# EAGLE design shield (EAGLE 9.1.3)
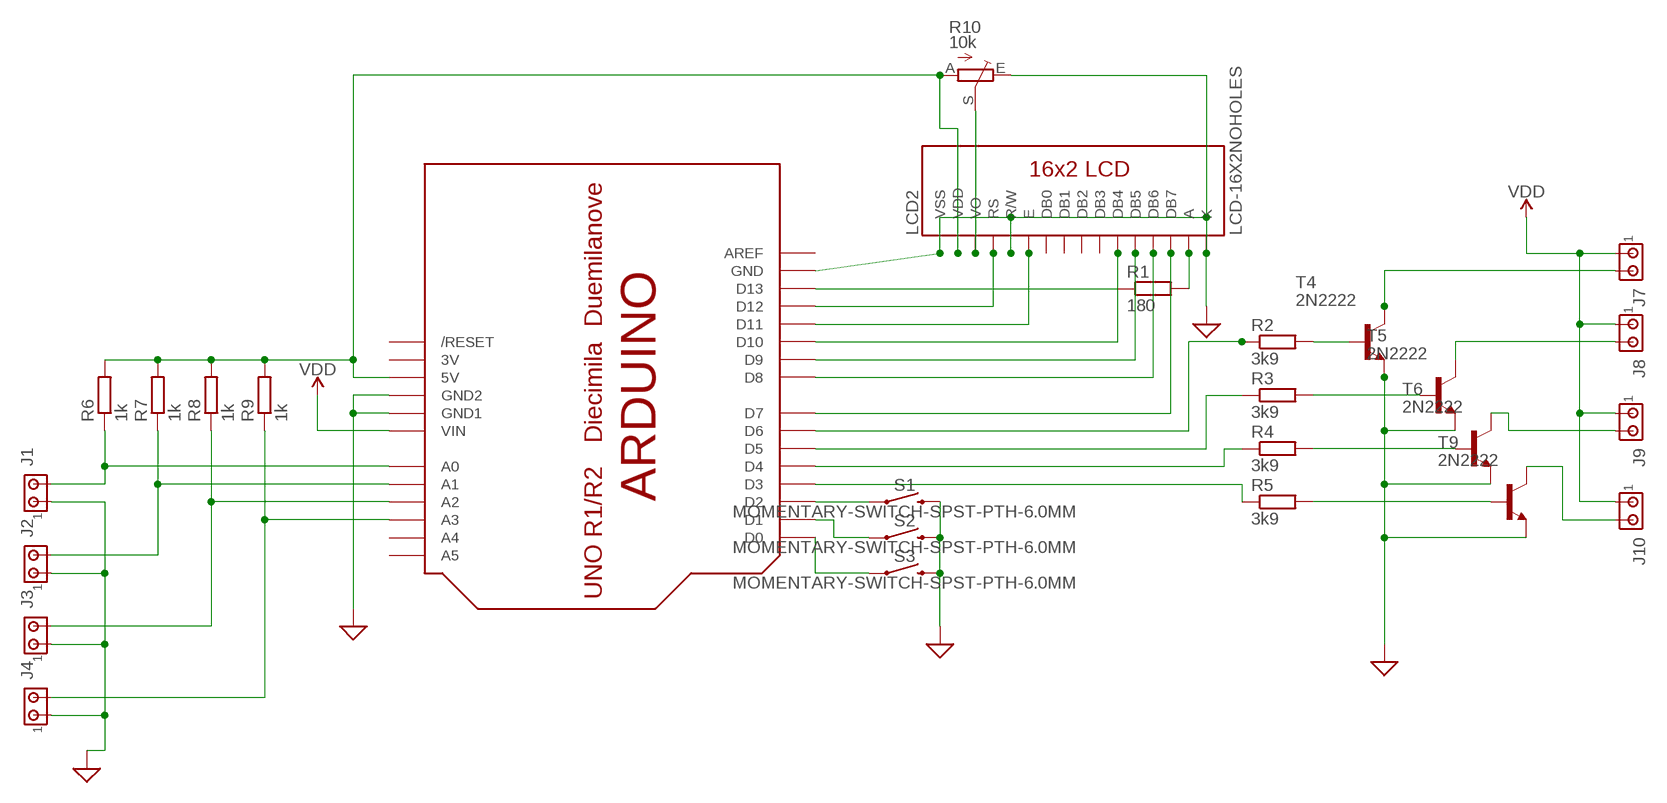
[diagram p0: schematic, sheet 1]

## Parts
J1  MTA02-100  [10X02MTA]
J2  MTA02-100  [10X02MTA]
J3  MTA02-100  [10X02MTA]
J4  MTA02-100  [10X02MTA]
J7  MTA02-100  [10X02MTA]
J8  MTA02-100  [10X02MTA]
J9  MTA02-100  [10X02MTA]
J10  MTA02-100  [10X02MTA]
LCD2  LCD-16X2NOHOLES  [LCD-16X2_NOHOLESNOSILK]
R1  180  R-EU_0207/10  [0207/10]
R2  3k9  R-EU_0207/10  [0207/10]
R3  3k9  R-EU_0207/10  [0207/10]
R4  3k9  R-EU_0207/10  [0207/10]
R5  3k9  R-EU_0207/10  [0207/10]
R6  1k  R-EU_0207/10  [0207/10]
R7  1k  R-EU_0207/10  [0207/10]
R8  1k  R-EU_0207/10  [0207/10]
R9  1k  R-EU_0207/10  [0207/10]
R10  10k  TRIM_EU-B25P  [B25P]
S1  MOMENTARY-SWITCH-SPST-PTH-6.0MM  [TACTILE_SWITCH_PTH_6.0MM]
S2  MOMENTARY-SWITCH-SPST-PTH-6.0MM  [TACTILE_SWITCH_PTH_6.0MM]
S3  MOMENTARY-SWITCH-SPST-PTH-6.0MM  [TACTILE_SWITCH_PTH_6.0MM]
T4  2N2222  [TO92-EBC-OVAL]
T5  2N2222  [TO92-EBC-OVAL]
T6  2N2222  [TO92-EBC-OVAL]
T9  2N2222  [TO92-EBC-OVAL]
U$1  ARDUINO-NOHOLE  [ARDUINO-NOHOLE]

## Nets
GND: J1.1 J2.1 J3.1 J4.1 LCD2.1(VSS) LCD2.5(R/W) LCD2.16(K) R10.E S1.3 S2.3 S3.3 T4.E T5.E T6.E T9.E U$1.GND U$1.GND1 U$1.GND2 ; supply symbol labelled SUP
N$1: LCD2.15(A) R1.2
N$6: LCD2.11(DB4) U$1.D10
N$7: LCD2.12(DB5) U$1.D9
N$8: LCD2.13(DB6) U$1.D8
N$9: LCD2.14(DB7) U$1.D7
N$10: LCD2.6(E) U$1.D11
N$11: R3.1 U$1.D5
N$12: J1.2 R6.1 U$1.A0
N$13: LCD2.4(RS) U$1.D12
N$14: LCD2.2(VDD) R6.2 R7.2 R8.2 R9.2 R10.A U$1.5V
N$15: LCD2.3(VO) R10.S
N$16: R4.1 U$1.D4
N$17: R1.1 U$1.D13
N$18: R5.1 U$1.D3
N$19: S3.1 U$1.D0
N$20: R2.1 U$1.D6
N$21: S1.1 U$1.D2
N$22: S2.1 U$1.D1
N$23: J8.2 T5.C
N$24: R3.2 T5.B
N$25: J7.2 T4.C
N$26: R2.2 T4.B
N$27: J2.2 R7.1 U$1.A1
N$28: R4.2 T6.B
N$29: R5.2 T9.B
N$30: J10.2 T9.C
N$31: J9.2 T6.C
N$32: J3.2 R8.1 U$1.A2
N$33: J4.2 R9.1 U$1.A3
VDD: J7.1 J8.1 J9.1 J10.1 U$1.VIN
Unconnected: LCD2.7(DB0) LCD2.8(DB1) LCD2.9(DB2) LCD2.10(DB3) U$1.A4 U$1.A5 U$1.AREF U$1.RESET(/RESET)

## Power pins joined to a net without a drawn wire
3V: U$1.3V

## Library data of the parts
J1-J4 J7-J10 = con-amp:MTA02-100: AMP connector; OC_FARNELL: unknown
LCD2 = SparkFun-Displays:LCD-16X2: Standard text-only 16x2 parallel input LCD Basic 16 character by 2 line display. Typically utilizes the extremely common HD44780 parallel interface chipset SparkFun Products: Basic 16x2 Green <https://www.sparkfun.com/products/255> Basic 8x2 Green <https://www.sparkfun.com/products/11122>; OC_FARNELL: unknown; SF_ID: LCD-00255
R1-R9 = rcl:R-EU_: RESISTOR, European symbol; OC_FARNELL: unknown; SPICEPREFIX: R
R10 = pot:TRIM_EU-: POTENTIOMETER; OC_FARNELL: unknown
S1-S3 = SparkFun-Switches:MOMENTARY-SWITCH-SPST: Momentary Switch (Pushbutton) - SPST Normally-open (NO) SPST momentary switches (buttons, pushbuttons). Variants PTH-12MM - 12mm square, through-hole Momentary Pushbutton Switch - 12mm Square <https://www.sparkfun.com/products/9190> (COM-09190) PTH-6.0MM, PTH-6.0MM-KIT - 6.0mm square, through-hole Mini Pushbutton Switch <https://www.sparkfun.com/products/97> (COM-00097) KIT package intended for soldering kit's - only one side of pads' copper is exposed. PTH-RIGHT-ANGLE-KIT - Right-angle, through-hole Right Angle Tactile Button <https://www.sparkfun.com/products/10791> - Used on SparkFun BigTime Watch Kit <https://www.sparkfun.com/products/11734> SMD-12MM - 12mm square, surface-mount Tactile Button - SMD (12mm) <https://www.sparkfun.com/products/12993> (COM-12993) Used on SparkFun PicoBoard <https://www.sparkfun.com/products/11888> SMD-4.5MM - 4.5mm Square Trackball Switch Used on SparkFun Blackberry Trackballer Breakout <https://www.sparkfun.com/products/13169> SMD-4.6MMX2.8MM - 4.60mm x 2.80mm, surface mount Used on SparkFun SAMD21 Mini Breakout <https://www.sparkfun.com/products/13664> SMD-5.2MM, SMD-5.2-REDUNDANT - 5.2mm square, surface-mount Mini Pushbutton Switch - SMD <https://www.sparkfun.com/products/8720> (COM-08720) Used on Arduino Pro Mini <https://www.sparkfun.com/products/11114> REDUNDANT package connects both switch circuits together SMD-6.0X3.5MM - 6.0 x 3.5mm, surface mount Momentary Reset Switch SMD <https://www.sparkfun.com/products/8229> (COM-08229) SMD-6.2MM-TALL - 6.2mm square, surface mount Tactile Button - SMD (6mm) <https://www.sparkfun.com/products/12992> Used on SparkFun Digital Sandbox <https://www.sparkfun.com/products/12651> SMD-RIGHT-ANGLE - Right-angle, surface mount Used on SparkFun Block for Intel® Edison - Arduino <https://www.sparkfun.com/products/13036>; OC_FARNELL: unknown; PROD_ID: SWCH-08441; SF_SKU: COM-00097
T4-T6 T9 = adafruit:2N2222: NPN TRANSISTOR Big oval pads; OC_FARNELL: unknown
U$1 = adafruit:ARDUINO: Arduino Diecimila/Duemilanove Make a shield with ease, this package has all the named pins as well as the two mounting drill holes and an outline of the USB and DC power connector. The outline is on the DIMENSION layer, so if your board house uses it they will cut the outline to match. http://www.ladyada.net/library/pcb/eaglelibrary.html; OC_FARNELL: unknown

## Net classes
0 default: width 0.762 mm, drill 0.787 mm, clearance 0.254 mm

## Board
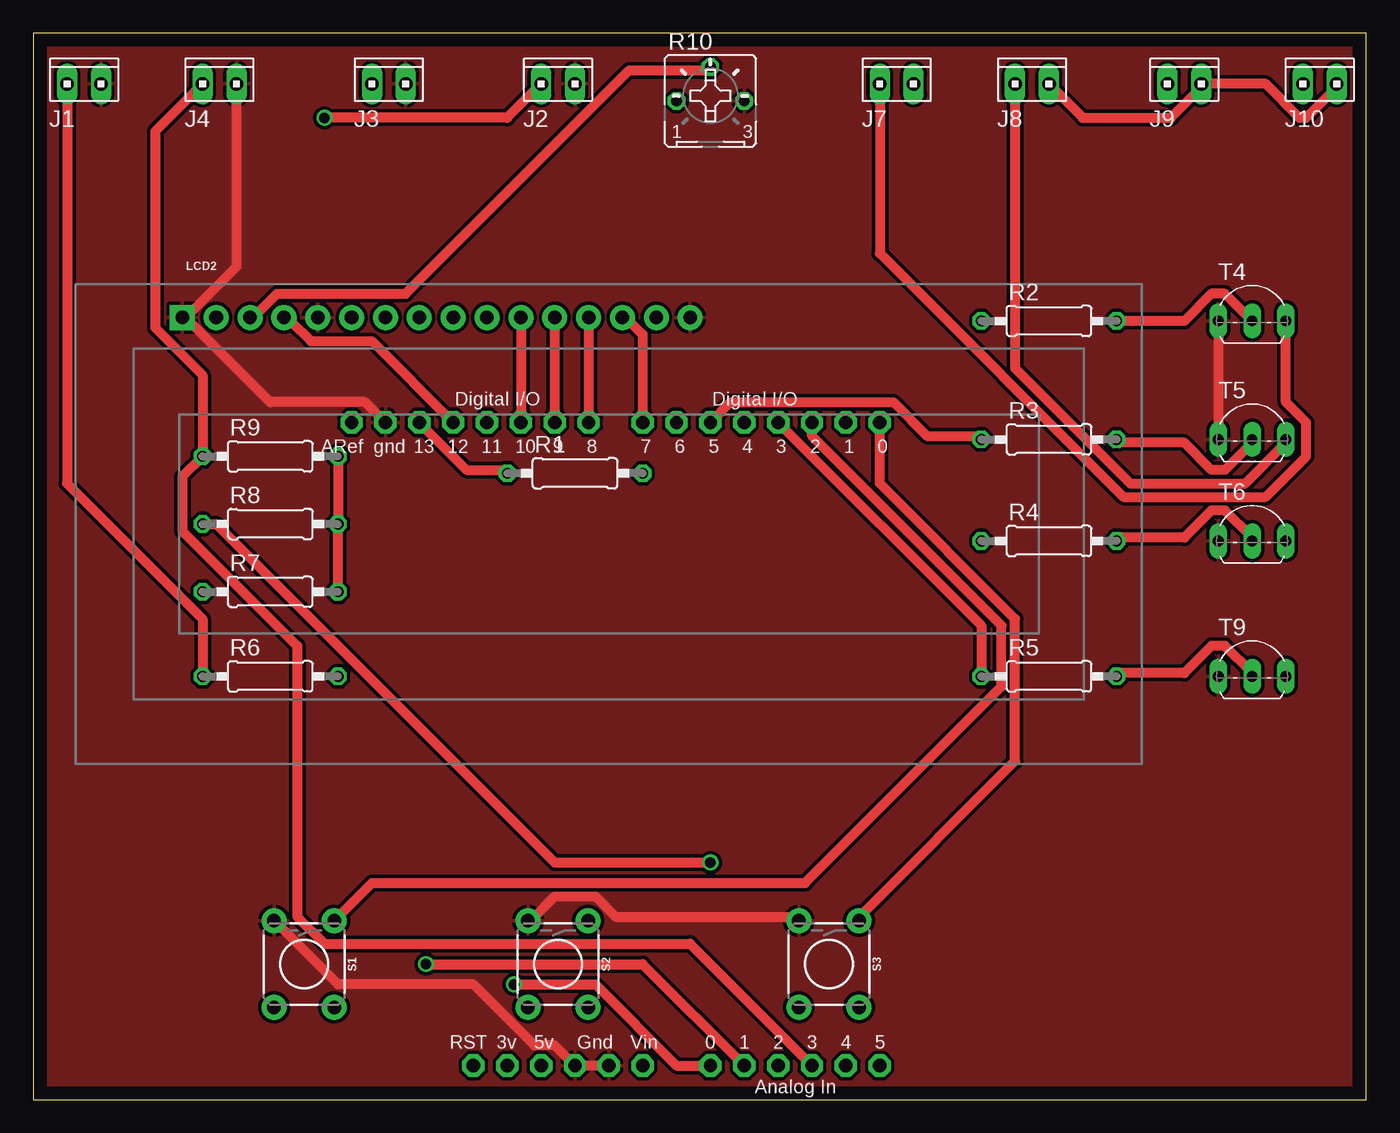
[diagram p1: board, top side]
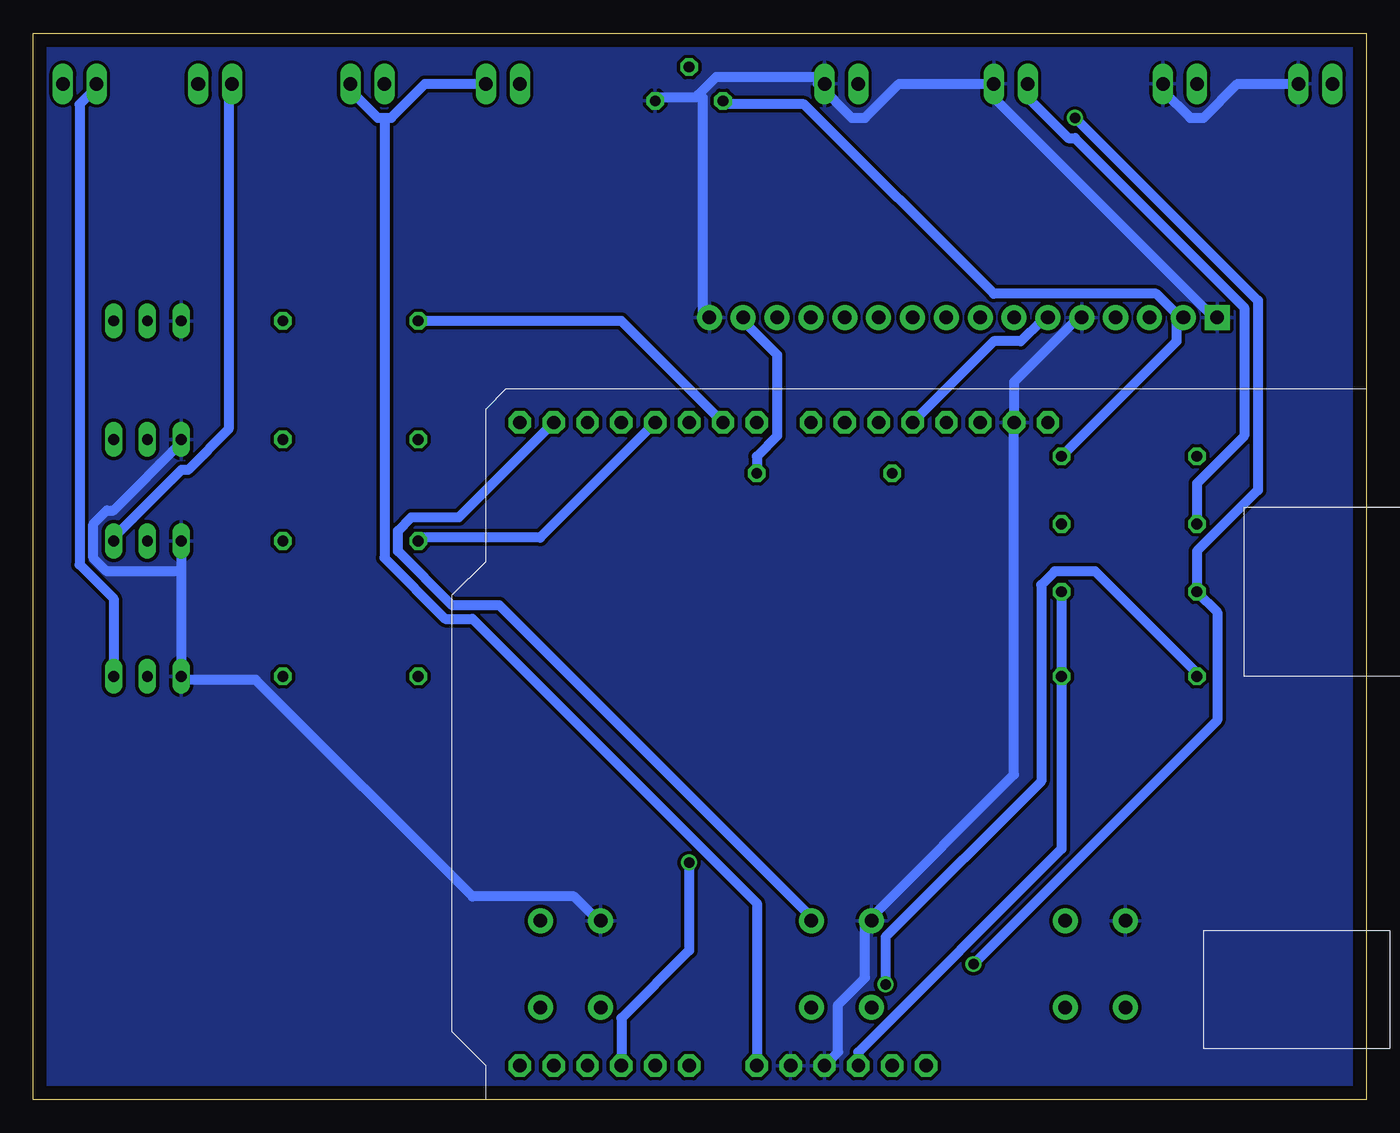
[diagram p2: board, bottom side, seen from below]

Size 100 x 80 mm. Coordinates in mm from the lower left corner, seen from the top.
Outline: 0,0 100,0 100,80 0,80 0,0
Copper layers (1*16): Top 0.035mm / dielectric 1.5mm / Bottom 0.035mm
Design rules "default": minimum track width 6mil, minimum drill 0.35mm, track to track 6mil, track to pad 6mil, pad to pad 6mil, via to via 6mil, smd to smd 6mil, copper to edge 40mil, drill to drill 6mil, minimum pad ring 10mil, minimum via ring 8mil, stop-mask expansion 4mil, vias tented up to drill 0mil, thermal gap 10mil

### Footprints (pad centres in the part's own frame; a part is rotated, then mirrored left to right if it is on the bottom)
10X02MTA = drill 1.016 long: 1 1.27,0; 2 -1.27,0
LCD-16X2_NOHOLESNOSILK = drill 1.016 pad 1.88 square: 1 -32,15.5 | drill 1.016 pad 1.88: 2 -29.46,15.5; 3 -26.92,15.5; 4 -24.38,15.5; 5 -21.84,15.5; 6 -19.3,15.5; 7 -16.76,15.5; 8 -14.22,15.5; 9 -11.68,15.5; 10 -9.14,15.5; 11 -6.6,15.5; 12 -4.06,15.5; 13 -1.52,15.5; 14 1.02,15.5; 15 3.56,15.5; 16 6.1,15.5
0207/10 = drill 0.813 octagon: 1 -5.08,0; 2 5.08,0
B25P = drill 0.813 octagon: A -2.54,0; E 2.54,0; S 0,2.54
TACTILE_SWITCH_PTH_6.0MM = drill 1.016 pad 1.88: 1 -3.251,2.261; 2 3.251,2.261; 3 -3.251,-2.261; 4 3.251,-2.261
TO92-EBC-OVAL = drill 0.813 long: B 0,-1.27; C 2.54,-1.27; E -2.54,-1.27
ARDUINO-NOHOLE = drill 1 pad 1.676 octagon: 3V 35.56,2.54; 5V 38.1,2.54; A0 50.8,2.54; A1 53.34,2.54; A2 55.88,2.54; A3 58.42,2.54; A4 60.96,2.54; A5 63.5,2.54; AREF 23.876,50.8; D0 63.5,50.8; D1 60.96,50.8; D2 58.42,50.8; D3 55.88,50.8; D4 53.34,50.8; D5 50.8,50.8; D6 48.26,50.8; D7 45.72,50.8; D8 41.656,50.8; D9 39.116,50.8; D10 36.576,50.8; D11 34.036,50.8; D12 31.496,50.8; D13 28.956,50.8; GND 26.416,50.8; GND1 43.18,2.54; GND2 40.64,2.54; RESET 33.02,2.54; VIN 45.72,2.54

### Placement (x,y rotation side)
J1  3.81,76.2 0 top
J2  39.37,76.2 0 top
J3  26.67,76.2 0 top
J4  13.97,76.2 0 top
J7  64.77,76.2 0 top
J8  74.93,76.2 0 top
J9  86.36,76.2 0 top
J10  96.52,76.2 0 top
LCD2  43.18,43.18 0 top
R1  40.64,46.99 0 top
R2  76.2,58.42 0 top
R3  76.2,49.53 0 top
R4  76.2,41.91 0 top
R5  76.2,31.75 0 top
R6  17.78,31.75 0 top
R7  17.78,38.1 0 top
R8  17.78,43.18 0 top
R9  17.78,48.26 0 top
R10  50.8,74.93 0 top
S1  20.32,10.16 270 top
S2  39.37,10.16 270 top
S3  59.69,10.16 270 top
T4  91.44,59.69 0 top
T5  91.44,50.8 0 top
T6  91.44,43.18 0 top
T9  91.44,33.02 0 top
U$1  0,0 0 top

### Tracks (layer width: path | path; a pad name or v marks a point on that pad's centre or on a via)
GND
  Top 0.762: U$1.GND 24.89,52.32 17.78,52.32 11.68,58.42 LCD2.1 11.68,58.93 15.24,62.48 J4.1 | T4.E T5.E | U$1.GND1 U$1.GND2 39.12,4.06 37.59,4.06 33.02,8.64 22.86,8.64 18.29,13.21 S1.3 | S3.3 57.4,13.72 43.69,13.72 42.16,15.24 39.12,15.24 37.59,13.72 S2.3
  Bottom 0.762: 50.04,75.44 48.77,76.71 41.15,76.71 J2.1 41.15,76.2 38.61,73.66 37.59,73.66 35.05,76.2 J3.1 27.94,75.18 11.68,58.93 LCD2.1 | 50.04,75.44 50.29,75.18 53.34,75.18 R10.E | LCD2.16 49.78,58.93 49.78,75.18 50.04,75.44 | J1.1 9.65,76.2 12.19,73.66 13.21,73.66 15.24,75.69 J4.1 | LCD2.5 21.84,58.42 26.42,53.85 U$1.GND 26.42,24.38 37.08,13.72 S2.3 37.59,13.21 37.59,9.14 39.62,7.11 39.62,3.56 U$1.GND2 | T6.E 88.9,39.62 | 88.9,39.62 T9.E 88.9,31.5 83.31,31.5 67.06,15.24 59.44,15.24 57.91,13.72 S3.3 | 88.9,39.62 94.49,39.62 95.5,40.64 95.5,43.18 94.49,44.2 93.98,44.2 88.9,49.28 T5.E
  pour Top: 0,80.01 100.33,80.01 100.33,0 0,0
  pour Bottom: 0,80.01 100.33,80.01 100.33,0 0,0
N$1
  Bottom 0.762: R1.2 45.72,48.26 44.2,49.78 44.2,55.88 46.74,58.42 LCD2.15
N$6
  Top 0.762: U$1.D10 36.58,58.42 LCD2.11
N$7
  Top 0.762: U$1.D9 39.12,58.42 LCD2.12
N$8
  Top 0.762: U$1.D8 41.66,58.42 LCD2.13
N$9
  Top 0.762: U$1.D7 45.72,57.4 44.7,58.42 LCD2.14
N$10
  Bottom 0.762: U$1.D11 27.94,56.9 25.91,56.9 24.38,58.42 LCD2.6
N$11
  Top 0.762: U$1.D5 52.32,52.32 64.52,52.32 67.06,49.78 71.12,49.78 R3.1
N$12  (via drill 0.79)
  Top 0.762: R6.1 12.7,36.07 2.54,46.23 J1.2 | U$1.A0 48.26,2.54 42.16,8.64 v36.07,8.64
  Bottom 0.762: v36.07,8.64 36.07,12.19 24.38,23.88 24.38,38.61 23.37,39.62 20.32,39.62 12.7,32 R6.1
N$13
  Top 0.762: U$1.D12 25.4,56.9 20.83,56.9 19.3,58.42 LCD2.4
N$14
  Top 0.762: R9.2 R8.2 R7.2
  Bottom 0.762: R10.A 48.26,74.68 42.16,74.68 27.94,60.45 15.75,60.45 14.22,58.93 LCD2.2 14.22,58.42 14.22,56.9 R9.2 | R7.2 R6.2 22.86,18.8 38.1,3.56 U$1.5V
N$15
  Top 0.762: R10.S 50.8,77.22 44.7,77.22 27.94,60.45 18.29,60.45 16.76,58.93 LCD2.3
N$16
  Bottom 0.762: U$1.D4 61.98,42.16 71.12,42.16 R4.1
N$17
  Top 0.762: U$1.D13 32.51,47.24 35.56,47.24 R1.1
N$18
  Top 0.762: R5.1 71.12,35.56 U$1.D3
N$19
  Top 0.762: U$1.D0 63.5,46.23 73.66,36.07 73.66,25.4 61.98,13.72 S3.1
N$20
  Bottom 0.762: R2.1 55.88,58.42 U$1.D6
N$21
  Top 0.762: U$1.D2 58.42,49.78 72.64,35.56 72.64,30.99 57.91,16.26 25.4,16.26 22.86,13.72 S1.1
N$22
  Bottom 0.762: U$1.D1 68.07,43.69 71.63,43.69 72.64,42.67 72.64,41.15 68.58,37.08 65.02,37.08 41.66,13.72 S2.1
N$23
  Top 0.762: J8.2 73.66,54.86 82.3,46.23 90.93,46.23 93.98,49.28 T5.C
N$24
  Top 0.762: R3.2 81.28,49.28 86.36,49.28 88.39,47.24 89.41,47.24 91.44,49.28 T5.B
N$25
  Top 0.762: T4.C 93.98,52.32 95.5,50.8 95.5,48.26 92.46,45.21 81.79,45.21 63.5,63.5 J7.2
N$26
  Top 0.762: R2.2 86.36,58.42 88.39,60.45 89.41,60.45 T4.B
N$27  (via drill 0.79)
  Top 0.762: v21.84,73.66 35.56,73.66 J2.2 | U$1.A1 45.72,10.16 v29.46,10.16
  Bottom 0.762: v21.84,73.66 8.13,59.94 8.13,45.72 12.7,41.15 R7.1 11.18,36.58 11.18,28.45 v29.46,10.16
N$28
  Top 0.762: R4.2 81.28,42.16 86.36,42.16 88.39,44.2 89.41,44.2 91.44,42.16 T6.B
N$29
  Top 0.762: R5.2 81.28,32 86.36,32 88.39,34.04 89.41,34.04 91.44,32 T9.B
N$30
  Bottom 0.762: T9.C 93.98,37.59 96.52,40.13 96.52,74.68 95,76.2 J10.2
N$31
  Bottom 0.762: T6.C 93.98,42.16 88.9,47.24 88.39,47.24 85.34,50.29 85.34,76.2 J9.2
N$32  (via drill 0.79)
  Top 0.762: v50.8,17.78 39.12,17.78 13.72,43.18 R8.1
  Bottom 0.762: R8.1 12.7,46.23 9.14,49.78 9.14,59.44 21.84,72.14 22.35,72.14 25.4,75.18 J3.2 | U$1.A2 55.88,6.1 50.8,11.18 v50.8,17.78
N$33
  Top 0.762: J4.2 9.14,72.64 9.14,57.91 12.7,54.36 R9.1 11.18,46.74 11.18,42.67 19.81,34.04 19.81,13.72 21.84,11.68 49.28,11.68 U$1.A3
VDD
  Top 0.762: J10.1 98.04,76.2 95.5,73.66 95,73.66 92.46,76.2 J9.1 87.38,76.2 87.38,75.69 85.34,73.66 78.74,73.66 J8.1
  Bottom 0.762: J7.1 70.61,76.2 73.15,73.66 73.66,73.66 | 73.66,73.66 74.17,73.66 76.2,75.69 J8.1 | U$1.VIN 45.72,14.73 67.06,36.07 69.09,36.07 73.66,40.64 73.66,73.66